# EAGLE design McPiFace-60mmFan-V1 (EAGLE 7.4.0)
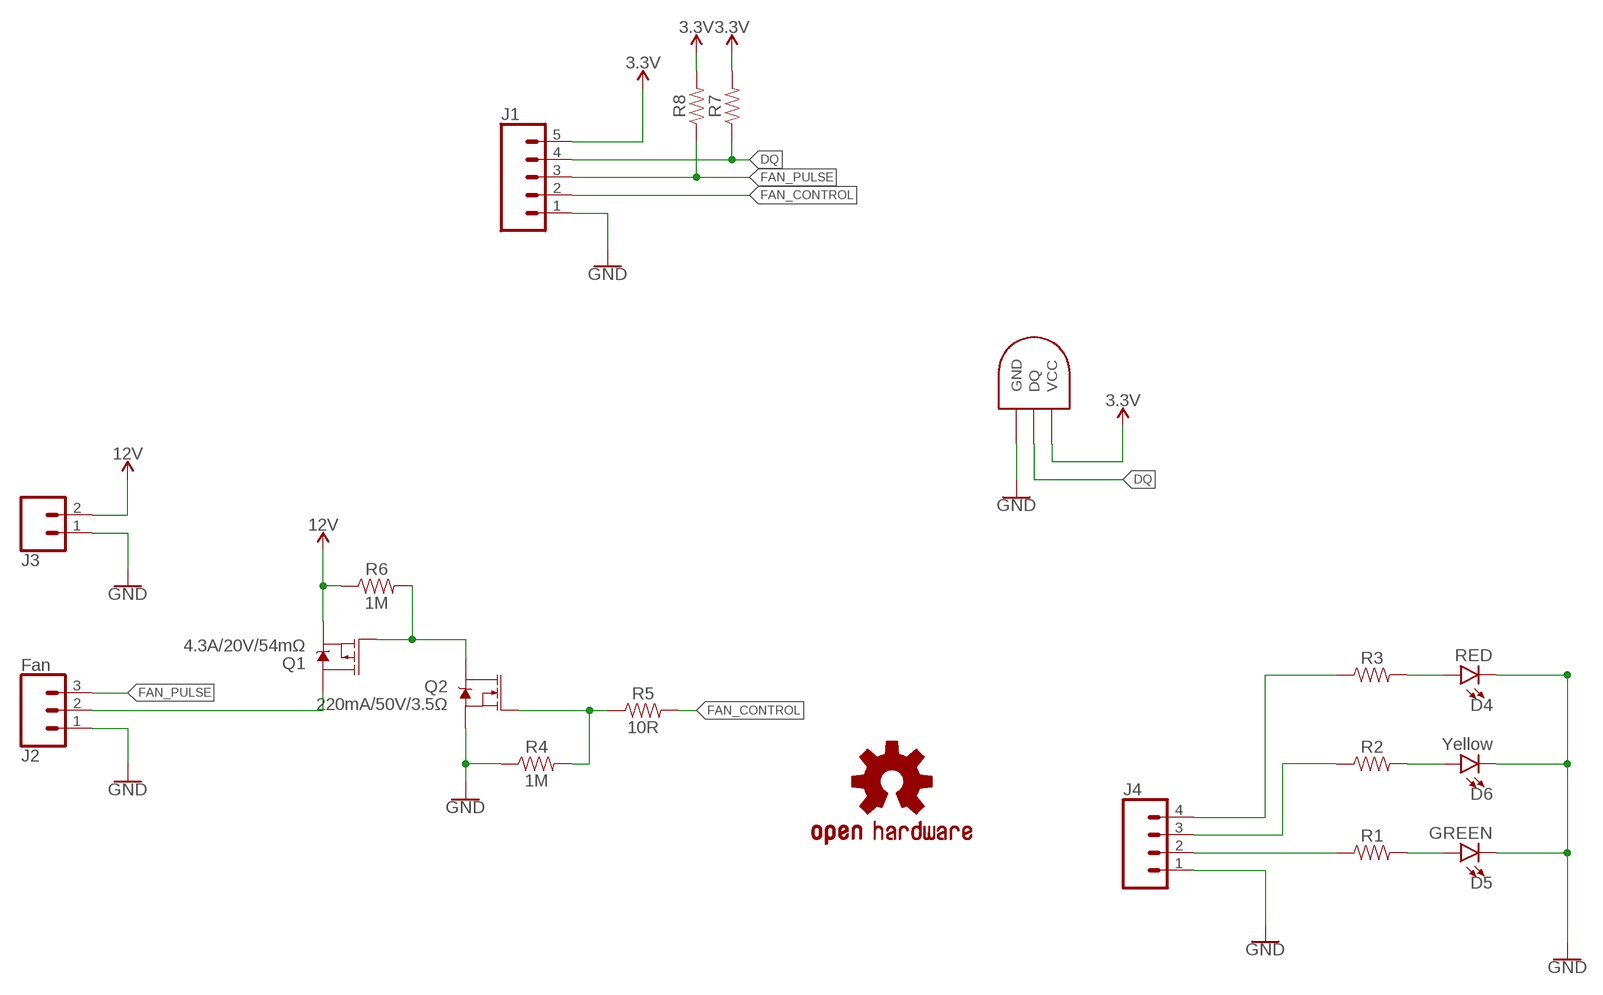
[diagram p0: schematic, sheet 1]

## Parts
D4  RED  LED-RED1206  [LED-1206]
D5  GREEN  LED-GREEN1206  [LED-1206]
D6  Yellow  LED-YELLOWLILYPAD  [LED-1206]
J1  CONN_05SMD  [1X05_1MM]
J2  Fan  CONN_03JST-SMD  [JST-3-SMD]
J3  CONN_02-JST-2MM-SMT  [JST-2-SMD]
J4  CONN_04SMD2  [1X04_1MM_RA]
LOGO1  OSHW-LOGOL  [OSHW-LOGO-L]
Q1  4.3A/20V/54mΩ  MOSFET_PCH-IRLML2244  [SOT23-3]
Q2  220mA/50V/3.5Ω  MOSFET-NCH-BSS138  [SOT23-3]
R1  RESISTOR1206  [1206]
R2  RESISTOR1206  [1206]
R3  RESISTOR1206  [1206]
R4  1M  RESISTOR0805  [0805]
R5  10R  RESISTOR0805  [0805]
R6  1M  RESISTOR0805  [0805]
R7  RESISTOR0805  [0805]
R8  RESISTOR0805  [0805]
U$1  DS1820SOIC  [DS18B20_SOIC]

## Nets
3.3V: J1.5 R7.2 R8.2 U$1.VCC
12V: J3.2 Q1.2(S) R6.1
DQ: J1.4 R7.1 U$1.DQ
FAN_CONTROL: J1.2 R5.2
FAN_PULSE: J1.3 J2.3 R8.1
GND: D4.C D5.C D6.C J1.1 J2.1 J3.1 J4.1 Q2.2(S) R4.1 U$1.GND
N$2: D4.A R3.2
N$3: D6.A R2.2
N$4: D5.A R1.2
N$5: J4.2 R1.1
N$6: J4.3 R2.1
N$7: J4.4 R3.1
N$8: J2.2 Q1.3(D)
N$10: Q1.1(G) Q2.3(D) R6.2
N$11: Q2.1(G) R4.2 R5.1

## Library data of the parts
D4 = SparkFun-LED:LED-RED: Red SMD LED Used in manufacturing of most products at SparkFun Packages: 0603 - SMD 0603 package [Product Link] <http://docs.avagotech.com/docs/AV02-0551EN> 0603 SMART - SMD 0603 SMART package ( more efficient and expensive)[Product Link] <http://www.osram-os.com/Graphics/XPic2/00077099_0.pdf> 1206 - SMD1206 package [Product Link] <https://www.sparkfun.com/datasheets/DevTools/LilyPad/Q150OVS4.pdff> SparkFun Products: Pro Mini 328 -5V <https://www.sparkfun.com/products/821> RedBoard <https://www.sparkfun.com/products/12757> IOIO-OTG <https://www.sparkfun.com/products/13613>; PROD_ID: DIO-09912
D5 = SparkFun-LED:LED-GREEN: Green SMD LED Used in manufacturing of various products at SparkFun Packages: 0603 - SMD 0603 package [Product Link] <http://www.futureelectronics.com/en/technologies/semiconductors/optoelectronics/leds/Pages/9894312-LTST-C190GKT.aspx?CrossPart=HSMG-C190&IM=0> LilyPad 1206 - SMD1206 LilyPad package [Product Link] <http://www.futureelectronics.com/en/Technologies/Product.aspx?ProductID=IN150NGHARVATEKCORPORATION2049943&IM=0> 1206 - SMD1206 package [Product Link] <http://www.futureelectronics.com/en/technologies/semiconductors/optoelectronics/leds/Pages/8315665-LTST-C150KGKT.aspx?IM=0> 1206 Bottom Mount -SMD 1206 Bottom Mount [Product Link] <http://www.digikey.com/product-detail/en/lite-on-inc/LTST-C230KGKT/160-1456-1-ND/386854> SparkFun Products: Pro Mini 328 -5V <https://www.sparkfun.com/products/821> RedBoard <https://www.sparkfun.com/products/12757> MP3 Trigger <https://www.sparkfun.com/products/13720> Makey Makey <https://www.sparkfun.com/products/11076>; PROD_ID: DIO-00862
D6 = SparkFun-LED:LED-YELLOW: Yellow SMD LED Used in manufacturing several products at SparkFun. Packages: 0603 - SMD 0603 package[Product Link] <http://www.kingbrightusa.com/product.asp?catalog_name=LED&product_id=APT1608SYCK> 0603 -SMART - SMART SMD 0603 package (more efficient/more expensive) [Product Link] <http://www.osram-os.com/osram_os/en/products/product-catalog/led-light-emitting-diodes/smartled-0603/ly-l29k/index.jsp> LilyPad - SMD1206 package[Product Datasheet] <https://www.sparkfun.com/datasheets/DevTools/LilyPad/Q150YUS4.pdf> SparkFun Products: Blynk Board <https://www.sparkfun.com/products/13794> IOIO-OTG <https://www.sparkfun.com/products/13613> XBee Explorer Serial <https://www.sparkfun.com/products/13225>; PROD_ID: DIO-09909
J1 = SparkFun-Connectors:CONN_05: Multi connection point. Often used as Generic Header-pin footprint for 0.1 inch spaced/style header connections On any of the 0.1 inch spaced packages, you can populate with these: Break Away Headers - Straight <https://www.sparkfun.com/products/116> (PRT-00116) Break Away Male Headers - Right Angle <https://www.sparkfun.com/products/553> (PRT-00553) Female Headers <https://www.sparkfun.com/products/115> (PRT-00115) Break Away Headers - Machine Pin <https://www.sparkfun.com/products/117> (PRT-00117) Break Away Female Headers - Swiss Machine Pin <https://www.sparkfun.com/products/743> (PRT-00743) For SCREWTERMINALS and SPRING TERMINALS visit here: Screw Terimnals on SparkFun.com <https://www.sparkfun.com/search/results?term=Screw+Terminals> (5mm/3.5mm/2.54mm spacing) This device is also useful as a general connection point to wire up your design to another part of your project. Our various solder wires solder well into these plated through hole pads. Hook-Up Wire - Assortment (Stranded, 22 AWG) <https://www.sparkfun.com/products/11375> (PRT-11375) Hook-Up Wire - Assortment (Solid Core, 22 AWG) <https://www.sparkfun.com/products/11367> (PRT-11367) View the entire wire category on our website here <https://www.sparkfun.com/categories/141> Special notes: Molex polarized connector foot print use with SKU : PRT-08231 with associated crimp pins and housings. 1MM SMD Version SKU: PRT-10208; PROD_ID: CONN-08528; SF_ID: GPS-08288
J2 = SparkFun-Connectors:CONN_03: Multi connection point. Often used as Generic Header-pin footprint for 0.1 inch spaced/style header connections On any of the 0.1 inch spaced packages, you can populate with these: Break Away Headers - Straight <https://www.sparkfun.com/products/116> (PRT-00116) Break Away Male Headers - Right Angle <https://www.sparkfun.com/products/553> (PRT-00553) Female Headers <https://www.sparkfun.com/products/115> (PRT-00115) Break Away Headers - Machine Pin <https://www.sparkfun.com/products/117> (PRT-00117) Break Away Female Headers - Swiss Machine Pin <https://www.sparkfun.com/products/743> (PRT-00743) Stackable Header - 3 Pin (Female, 0.1") <https://www.sparkfun.com/products/13875> (PRT-13875) For SCREWTERMINALS and SPRING TERMINALS visit here: Screw Terimnals on SparkFun.com <https://www.sparkfun.com/search/results?term=Screw+Terminals> (5mm/3.5mm/2.54mm spacing) This device is also useful as a general connection point to wire up your design to another part of your project. Our various solder wires solder well into these plated through hole pads. Hook-Up Wire - Assortment (Stranded, 22 AWG) <https://www.sparkfun.com/products/11375> (PRT-11375) Hook-Up Wire - Assortment (Solid Core, 22 AWG) <https://www.sparkfun.com/products/11367> (PRT-11367) View the entire wire category on our website here <https://www.sparkfun.com/categories/141> Special notes: Molex polarized connector foot print use with SKU : PRT-08232 with associated crimp pins and housings.; PROD_ID: CONN-12591; VALUE: 3-PIN SMD
J3 = SparkFun-Connectors:CONN_02: Multi connection point. Often used as Generic Header-pin footprint for 0.1 inch spaced/style header connections On any of the 0.1 inch spaced packages, you can populate with these: Break Away Headers - Straight <https://www.sparkfun.com/products/116> (PRT-00116) Break Away Male Headers - Right Angle <https://www.sparkfun.com/products/553> (PRT-00553) Female Headers <https://www.sparkfun.com/products/115> (PRT-00115) Break Away Headers - Machine Pin <https://www.sparkfun.com/products/117> (PRT-00117) Break Away Female Headers - Swiss Machine Pin <https://www.sparkfun.com/products/743> (PRT-00743) For SCREWTERMINALS and SPRING TERMINALS visit here: Screw Terimnals on SparkFun.com <https://www.sparkfun.com/search/results?term=Screw+Terminals> (5mm/3.5mm/2.54mm spacing) This device is also useful as a general connection point to wire up your design to another part of your project. Our various solder wires solder well into these plated through hole pads. Hook-Up Wire - Assortment (Stranded, 22 AWG) <https://www.sparkfun.com/products/11375> (PRT-11375) Hook-Up Wire - Assortment (Solid Core, 22 AWG) <https://www.sparkfun.com/products/11367> (PRT-11367) View the entire wire category on our website here <https://www.sparkfun.com/categories/141> Special notes: Molex polarized connector foot print use with: PRT-08233 with associated crimp pins and housings. 2.54_SCREWTERM for use with PRT-10571. 3.5mm Screw Terminal footprints for PRT-08084 5mm Screw Terminal footprints for use with PRT-08432; PROD_ID: CONN-11443
J4 = SparkFun-Connectors:CONN_04: Multi connection point. Often used as Generic Header-pin footprint for 0.1 inch spaced/style header connections On any of the 0.1 inch spaced packages, you can populate with these: Break Away Headers - Straight <https://www.sparkfun.com/products/116> (PRT-00116) Break Away Male Headers - Right Angle <https://www.sparkfun.com/products/553> (PRT-00553) Female Headers <https://www.sparkfun.com/products/115> (PRT-00115) Break Away Headers - Machine Pin <https://www.sparkfun.com/products/117> (PRT-00117) Break Away Female Headers - Swiss Machine Pin <https://www.sparkfun.com/products/743> (PRT-00743) For SCREWTERMINALS and SPRING TERMINALS visit here: Screw Terimnals on SparkFun.com <https://www.sparkfun.com/search/results?term=Screw+Terminals> (5mm/3.5mm/2.54mm spacing) This device is also useful as a general connection point to wire up your design to another part of your project. Our various solder wires solder well into these plated through hole pads. Hook-Up Wire - Assortment (Stranded, 22 AWG) <https://www.sparkfun.com/products/11375> (PRT-11375) Hook-Up Wire - Assortment (Solid Core, 22 AWG) <https://www.sparkfun.com/products/11367> (PRT-11367) View the entire wire category on our website here <https://www.sparkfun.com/categories/141> Special notes: Molex polarized connector foot print use with SKU : PRT-08231 with associated crimp pins and housings. 1MM SMD Version SKU: PRT-10208; PROD_ID: CONN-10310; SF_ID: PRT-10208
LOGO1 = SparkFun-Aesthetics:OSHW-LOGO: Open-Source Hardware (OSHW) Logo This logo indicates the piece of hardware it is found on incorporates a OSHW license and/or adheres to the definition of open source hardware found here: http://freedomdefined.org/OSHW
Q1 = SparkFun-DiscreteSemi:MOSFET_PCH: P-channel MOSFETs Voltage controlled devices that allow control of high current outputs. SparkFun Products: SparkFun ESP32 Thing <https://www.sparkfun.com/products/13907> SparkFun ESP8266 Thing <https://www.sparkfun.com/products/13231>; PROD_ID: TRANS-11153
Q2 = SparkFun-DiscreteSemi:MOSFET-NCH: N-channel MOSFETs Voltage controlled devices that allow control of high current outputs. SparkFun Products: SparkFun OpenScale <https://www.sparkfun.com/products/13261> SparkFun Digital Sandbox <https://www.sparkfun.com/products/12651> SparkFun Monster Moto Shield <https://www.sparkfun.com/products/10182> SparkFun MOSFET Power Controller <https://www.sparkfun.com/products/11214>; PROD_ID: TRANS-00830
R1-R8 = SparkFun-Resistors:RESISTOR: Generic Resistor Package
U$1 = DS1820-SOIC:DS1820

## Board
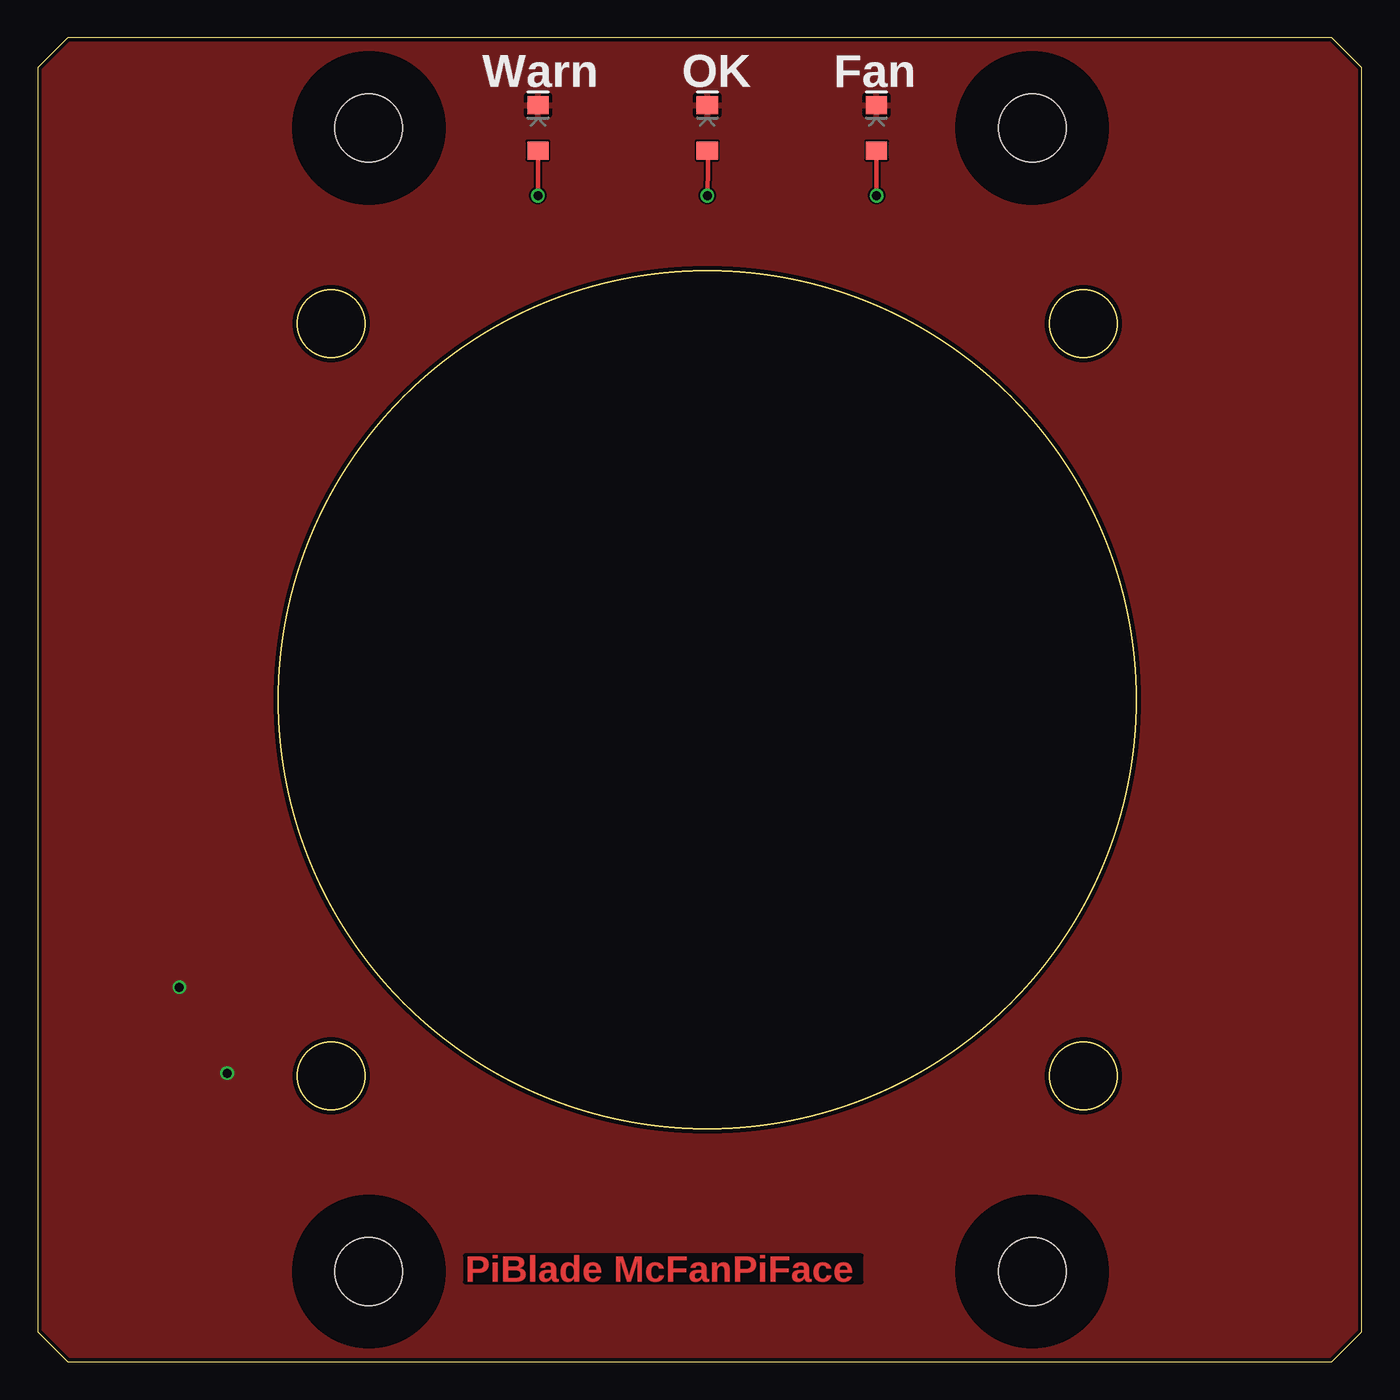
[diagram p1: board, top side]
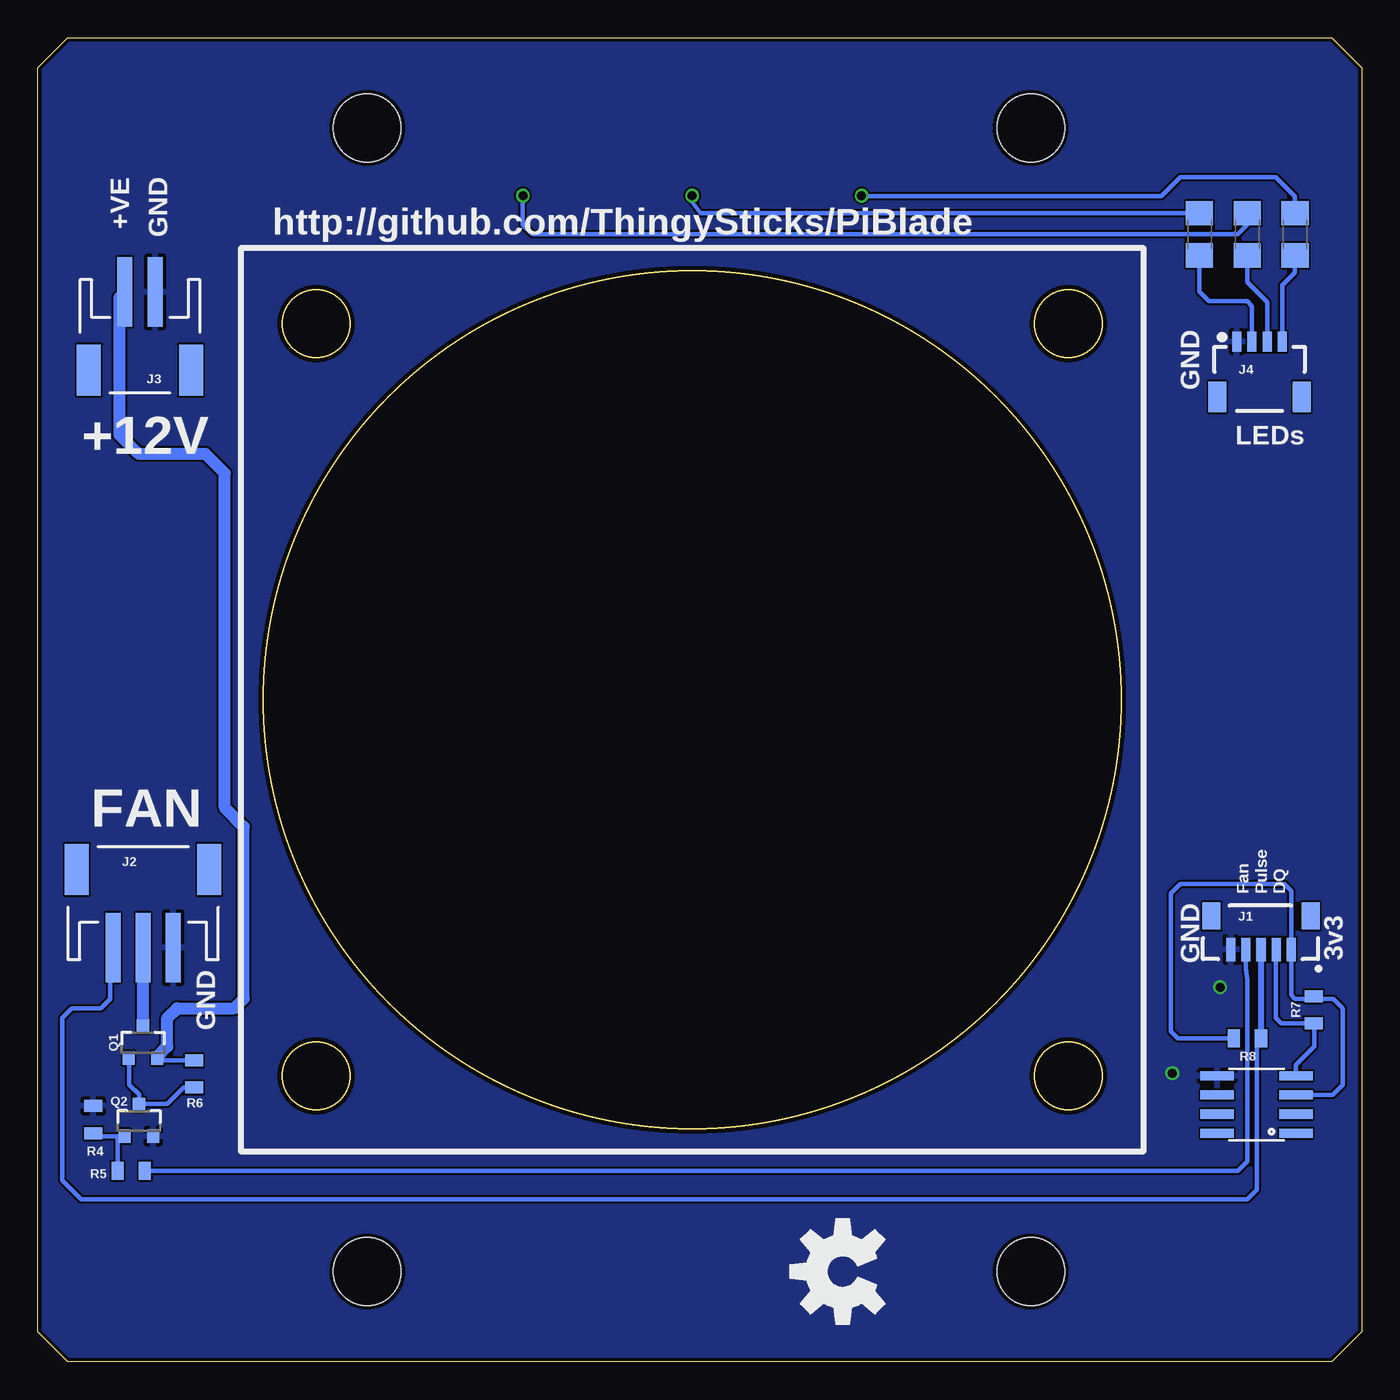
[diagram p2: board, bottom side, seen from below]

Size 88 x 88 mm. Coordinates in mm from the lower left corner, seen from the top.
Outline: 2,0 86,0 88,2 88,86 86,88 2,88 0,86 0,2 2,0
Outline: circle at 44.5,44 radius 28.5
Outline: circle at 19.5,69 radius 2.25
Outline: circle at 69.5,69 radius 2.25
Outline: circle at 69.5,19 radius 2.25
Outline: circle at 19.5,19 radius 2.25
Copper layers (1*16): Top 0.035mm / dielectric 1.5mm / Bottom 0.035mm
Design rules "dirt_cheap_dirty_boards.v1": minimum track width 5mil, minimum drill 12mil, track to track 5mil, track to pad 5mil, pad to pad 5mil, via to via 5mil, smd to smd 0mil, copper to edge 10mil, drill to drill 10mil, minimum pad ring 10mil, minimum via ring 6mil, stop-mask expansion 2mil, vias tented up to drill 25mil, thermal gap 10mil
Holes 4.5 mm at 22,6 22,82 66.1,82 66.1,6
tRestrict: area 17,77 to 27,87; area 17,1 to 27,11; area 61.1,1 to 71.1,11; area 61.1,77 to 71.1,87

### Footprints (pad centres in the part's own frame; a part is rotated, then mirrored left to right if it is on the bottom)
LED-1206 = smd 1.2 x 1.4: A -1.5,0; C 1.5,0
1X05_1MM = smd 0.6 x 1.55: 1 -2,0; 2 -1,0; 3 0,0; 4 1,0; 5 2,0 | smd 1.2 x 1.8: NC1 -3.3,2.225; NC2 3.3,2.225
JST-3-SMD = smd 1 x 4.6: 1 2.01,-4.77; 2 0.01,-4.77; 3 -1.99,-4.77 | smd 1.6 x 3.4: NC1 -4.39,0.43; NC2 4.41,0.43
JST-2-SMD = smd 1 x 4.6: 1 -1,-3.7; 2 1,-3.7 | smd 1.6 x 3.4: NC1 -3.4,1.5; NC2 3.4,1.5
1X04_1MM_RA = smd 0.6 x 1.35: 1 -1.5,0; 2 -0.5,0; 3 0.5,0; 4 1.5,0 | smd 1.2 x 2: NC1 2.8,-3.675; NC2 -2.8,-3.675
SOT23-3 = smd 0.8 x 0.9: 1 -0.95,-1; 2 0.95,-1; 3 0,1.1
1206 = smd 1.6 x 1.8: 1 -1.4,0; 2 1.4,0
0805 = smd 0.8 x 1.2: 1 -0.9,0; 2 0.9,0
DS18B20_SOIC = smd 0.61 x 2.21: DQ 1.905,-2.616; GND 1.905,2.616; NC -1.905,-2.616; NC2 -0.635,-2.616; NC3 -1.905,2.616; NC4 -0.635,2.616; NC5 0.635,2.616; VCC 0.635,-2.616

### Placement (x,y rotation side)
D4  33.25,82 90 top
D5  44.5,82 90 top
D6  55.75,82 90 top
J1  6.7,27.4 0 bottom
J2  81,32.3 0 bottom
J3  81.2,67.4 180 bottom
J4  6.8,67.8 0 bottom
LOGO1  34.5,6 90 bottom
Q1  81,21.2 0 bottom
Q2  81.27,16 0 bottom
R1  10.79,74.93 90 bottom
R2  7.62,74.93 90 bottom
R3  4.45,74.93 90 bottom
R4  84.3,16.1 270 bottom
R5  81.78,12.71 0 bottom
R6  77.6,19.13 270 bottom
R7  3.2,23.4 90 bottom
R8  7.6,21.5 180 bottom
U$1  7,17.1 90 bottom

### Tracks (layer width: path | path; a pad name or v marks a point on that pad's centre or on a via)
3.3V
  Bottom 0.305: U$1.VCC 1.95,17.73 1.27,18.41 1.27,23.5 1.91,24.13 3.03,24.13 R7.2 3.37,24.13 4.45,24.13 4.7,24.39 J1.5 4.7,31.3 5.15,31.75 12.06,31.75 12.7,31.11 12.7,21.96 12.24,21.5 R8.2
12V
  Bottom 0.305: R6.1 79.88,20.03 Q1.2
  Bottom 0.813: Q1.2 80.05,20.28 79.38,20.95 79.38,22.86 78.74,23.5 74.93,23.5 74.3,24.13 74.3,35.56 75.56,36.83 75.56,59.05 76.83,60.33 81.28,60.33 82.55,61.59 82.55,70.75 J3.2
DQ
  Bottom 0.305: U$1.DQ 4.38,19.75 3.17,20.95 3.17,22.48 R7.1 5.36,22.5 5.71,22.86 5.71,27.39 J1.4
FAN_CONTROL
  Bottom 0.305: J1.2 7.7,26.11 7.62,25.4 7.62,13.34 8.26,12.7 78.11,12.7 78.11,12.71 R5.2
FAN_PULSE
  Bottom 0.305: J1.3 6.7,26.39 | J2.3 83.19,27.34 83.19,24.13 83.82,23.5 85.72,23.5 86.36,22.86 86.36,12.06 85.09,10.79 7.62,10.79 6.99,11.43 6.99,21.21 R8.1
  Bottom 0.406: R8.1 J1.3
GND  (via drill 0.6)
  other vias: 9.42,24.89 12.6,19.18
  pour Top: -1,88.5 88.7,88.5 88.7,-1 -1,-1
  pour Bottom: -1,88.5 88.7,88.5 88.7,-1 -1,-1
N$2  (via drill 0.6)
  Top 0.305: v33.25,77.5 33.24,79.94 D4.A
  Bottom 0.305: R3.2 4.45,77.47 5.71,78.74 12.06,78.74 13.34,77.47 33.24,77.47 v33.25,77.5
N$3  (via drill 0.6)
  Top 0.305: v55.75,77.5 D6.A
  Bottom 0.305: v55.75,77.5 55.76,76.52 55.76,75.56 55.12,74.93 8.26,74.93 7.62,75.56 R2.2
N$4  (via drill 0.6)
  Top 0.305: v44.5,77.5 44.55,79.45 D5.A
  Bottom 0.305: R1.2 43.95,76.33 44.55,77.14 v44.5,77.5
N$5
  Bottom 0.305: J4.2 7.3,70.17 7.62,70.48 10.16,70.48 10.79,71.12 R1.1
N$6
  Bottom 0.305: J4.3 6.3,70.44 7.62,71.75 R2.1
N$7
  Bottom 0.305: J4.4 5.3,71.53 4.45,72.39 R3.1
N$8
  Bottom 0.813: Q1.3 J2.2
N$10
  Bottom 0.305: Q1.1 81.92,20.16 81.92,18.41 81.27,17.77 Q2.3 81.22,17.14 79.38,17.14 78.29,18.23 R6.2
N$11
  Bottom 0.305: R5.1 82.68,14.83 Q2.1 84.73,15 R4.2

### Text on the board
Top: PiBlade McFanPiFace
tNames: Warn | OK | Fan
bNames: GND | +VE | http://github.com/ThingySticks/PiBlade | GND | LEDs | +12V | FAN | Fan / Pulse / DQ | GND | 3v3 | GND